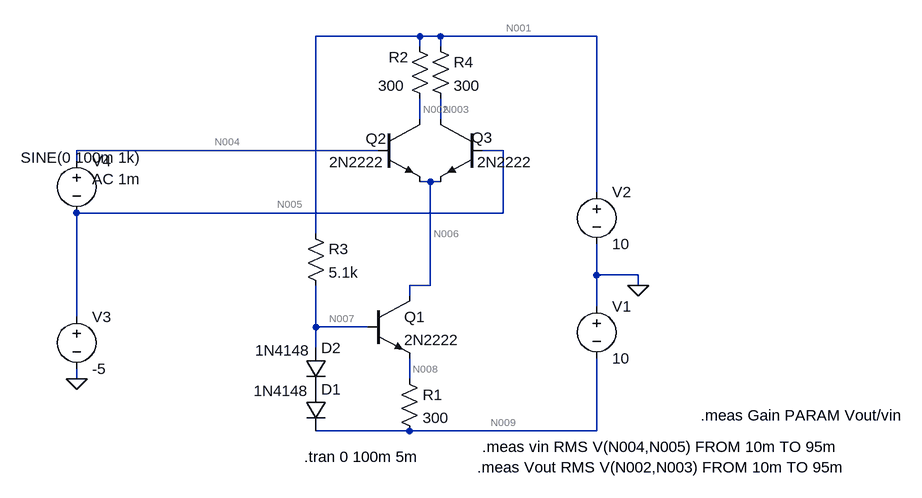
[diagram p0: schematic Draft4.asc]
Draft4.asc, the LTspice schematic file:
Version 4
SHEET 1 1212 680
WIRE 176 -368 16 -368
WIRE 208 -368 176 -368
WIRE 448 -368 208 -368
WIRE 176 -352 176 -368
WIRE 208 -352 208 -368
WIRE 176 -240 176 -272
WIRE 208 -240 208 -272
WIRE 112 -192 -352 -192
WIRE 304 -192 272 -192
WIRE -352 -176 -352 -192
WIRE 192 -144 176 -144
WIRE 208 -144 192 -144
WIRE 448 -128 448 -368
WIRE 304 -96 304 -192
WIRE 304 -96 -352 -96
WIRE 16 -64 16 -368
WIRE 448 0 448 -48
WIRE 512 0 448 0
WIRE 192 16 192 -144
WIRE 192 16 160 16
WIRE 512 16 512 0
WIRE 160 32 160 16
WIRE 448 48 448 0
WIRE -352 64 -352 -96
WIRE 16 80 16 16
WIRE 96 80 16 80
WIRE 16 112 16 80
WIRE -352 160 -352 144
WIRE 160 160 160 128
WIRE 160 240 16 240
WIRE 448 240 448 128
WIRE 448 240 160 240
FLAG -352 160 0
FLAG 512 16 0
SYMBOL res 144 144 R0
SYMATTR InstName R1
SYMATTR Value 300
SYMBOL diode 0 112 R0
WINDOW 3 -77 4 Left 2
SYMATTR InstName D2
SYMATTR Value 1N4148
SYMBOL npn 96 32 R0
SYMATTR InstName Q1
SYMATTR Value 2N2222
SYMBOL voltage 448 32 R0
WINDOW 123 0 0 Left 0
WINDOW 39 0 0 Left 0
SYMATTR InstName V1
SYMATTR Value 10
SYMBOL res 0 -80 R0
SYMATTR InstName R3
SYMATTR Value 5.1k
SYMBOL voltage 448 -144 R0
WINDOW 123 0 0 Left 0
WINDOW 39 0 0 Left 0
SYMATTR InstName V2
SYMATTR Value 10
SYMBOL npn 112 -240 R0
WINDOW 0 -19 30 Left 2
WINDOW 3 152 66 Left 2
SYMATTR InstName Q2
SYMATTR Value 2N2222
SYMBOL npn 272 -240 M0
WINDOW 0 -16 28 Left 2
WINDOW 3 151 66 Left 2
SYMATTR InstName Q3
SYMATTR Value 2N2222
SYMBOL res 160 -368 R0
WINDOW 0 -32 32 Left 2
WINDOW 3 -48 76 Left 2
SYMATTR InstName R2
SYMATTR Value 300
SYMBOL res 192 -368 R0
SYMATTR InstName R4
SYMATTR Value 300
SYMBOL voltage -352 48 R0
WINDOW 123 0 0 Left 0
WINDOW 39 0 0 Left 0
SYMATTR InstName V3
SYMATTR Value -5
SYMBOL voltage -352 -192 R0
WINDOW 3 -86 11 Left 2
WINDOW 123 24 44 Left 2
WINDOW 39 0 0 Left 0
SYMATTR InstName V4
SYMATTR Value SINE(0 100m 1k)
SYMATTR Value2 AC 1m
SYMBOL diode 0 176 R0
WINDOW 3 -80 2 Left 2
SYMATTR InstName D1
SYMATTR Value 1N4148
TEXT -2 280 Left 2 !.tran 0 100m 5m
TEXT 264 296 Left 2 !.meas Vout RMS V(N002,N003) FROM 10m TO 95m
TEXT 272 264 Left 2 !.meas vin RMS V(N004,N005) FROM 10m TO 95m
TEXT 608 216 Left 2 !.meas Gain PARAM Vout/vin

The netlist it stands for:
* Draft4.asc
R1 N008 N009 300
D2 N007 P001 1N4148
Q1 N006 N007 N008 0 2N2222
V1 0 N009 10
R3 N001 N007 5.1k
V2 N001 0 10
Q2 N002 N004 N006 0 2N2222
Q3 N003 N005 N006 0 2N2222
R2 N001 N002 300
R4 N001 N003 300
V3 N005 0 -5
V4 N004 N005 SINE(0 100m 1k) AC 1m
D1 P001 N009 1N4148
.model D D
.lib standard.dio
.model NPN NPN
.model PNP PNP
.lib standard.bjt
.tran 0 100m 5m
.meas Vout RMS V(N002,N003) FROM 10m TO 95m
.meas vin RMS V(N004,N005) FROM 10m TO 95m
.meas Gain PARAM Vout/vin
.backanno
.end

* Results of the author's LTspice run, read from the files saved beside the schematic
* Operating Point, zero values left out:
*   V(n008) = -9.383 V
*   V(n009) = -10 V
*   V(n007) = -8.71 V
*   V(p001) = -9.355 V
*   V(n006) = -5.652 V
*   V(n001) = 10 V
*   V(n002) = 9.695 V
*   V(n004) = -5 V
*   V(n003) = 9.695 V
*   V(n005) = -5 V
*   Ic(Q3) = 1.018 mA
*   Ib(Q3) = 4.451 µA
*   Ie(Q3) = -1.023 mA
*   Ic(Q2) = 1.018 mA
*   Ib(Q2) = 4.451 µA
*   Ie(Q2) = -1.023 mA
*   Ic(Q1) = 2.045 mA
*   Ib(Q1) = 9.988 µA
*   Ie(Q1) = -2.055 mA
*   I(D1) = 3.659 mA
*   I(D2) = 3.659 mA
*   I(R4) = 1.018 mA
*   I(R2) = 1.018 mA
*   I(R3) = 3.669 mA
*   I(R1) = 2.055 mA
*   I(V4) = -4.451 µA
*   I(V3) = -8.903 µA
*   I(V2) = -5.705 mA
*   I(V1) = -5.714 mA
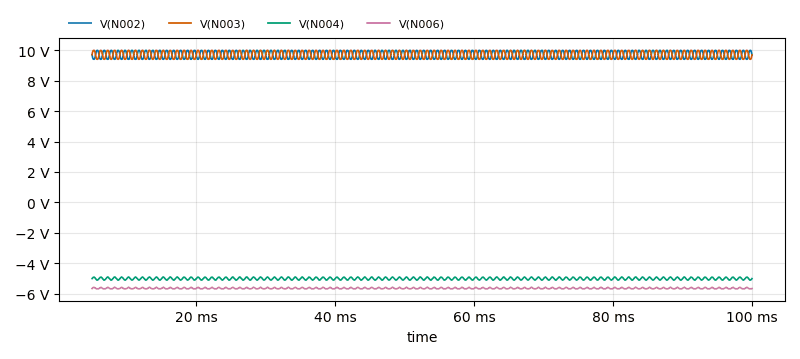
[diagram p1: Transient Analysis of Draft4.asc, plotted from the saved traces]
* Transient Analysis, 1 run:
*   V(N002): min 9.402 V, max 9.987 V, average 9.695 V, rms 9.697 V, last 9.695 V
*   V(N003): min 9.402 V, max 9.987 V, average 9.695 V, rms 9.697 V, last 9.695 V
*   V(N004): min -5.1 V, max -4.9 V, average -5 V, rms 5 V, last -5 V
*   V(N006): min -5.67 V, max -5.57 V, average -5.633 V, rms 5.633 V, last -5.652 V
* From the log:
*   vout: RMS(v(n002,n003))=0.451363 FROM 0.01 TO 0.095
*   vin: RMS(v(n004,n005))=0.068984 FROM 0.01 TO 0.095
*   gain: vout/vin=6.54301